# Altium schematic sheet interface.SchDoc
size A4
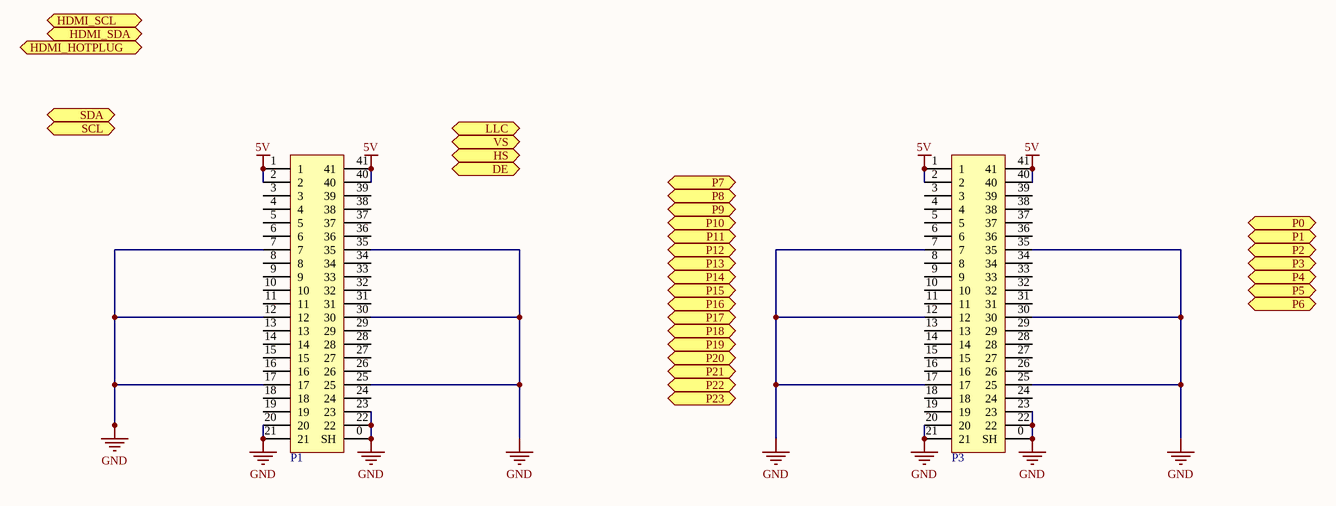
[diagram p0: interface.SchDoc]

## Parts
P1  DF9-41S  [DF9-41S]  (value not drawn)
P3  DF9-41S  [DF9-41S]  (value not drawn)

## Ports
DE, HDMI_HOTPLUG, HDMI_SCL, HDMI_SDA, HS, LLC, P0, P1, P2, P3, P4, P5, P6, P7, P8, P9, P10, P11, P12, P13, P14, P15, P16, P17, P18, P19, P20, P21, P22, P23, SCL, SDA, VS

## Nets
5V: P1.1 P1.2 P1.40 P1.41 P3.1 P3.2 P3.40 P3.41
GND: P1.0(SH) P1.7 P1.12 P1.17 P1.20 P1.21 P1.22 P1.23 P1.25 P1.30 P1.35 P3.0(SH) P3.7 P3.12 P3.17 P3.20 P3.21 P3.22 P3.23 P3.25 P3.30 P3.35

Not connected (* = marked no-connect by the designer): P1 3 4 5 6 8 9 10 11 13 14 15 16 18 19 24 26 27 28 29 31 32 33 34 36 37 38 39; P3 3 4 5 6 8 9 10 11 13 14 15 16 18 19 24 26 27 28 29 31 32 33 34 36 37 38 39